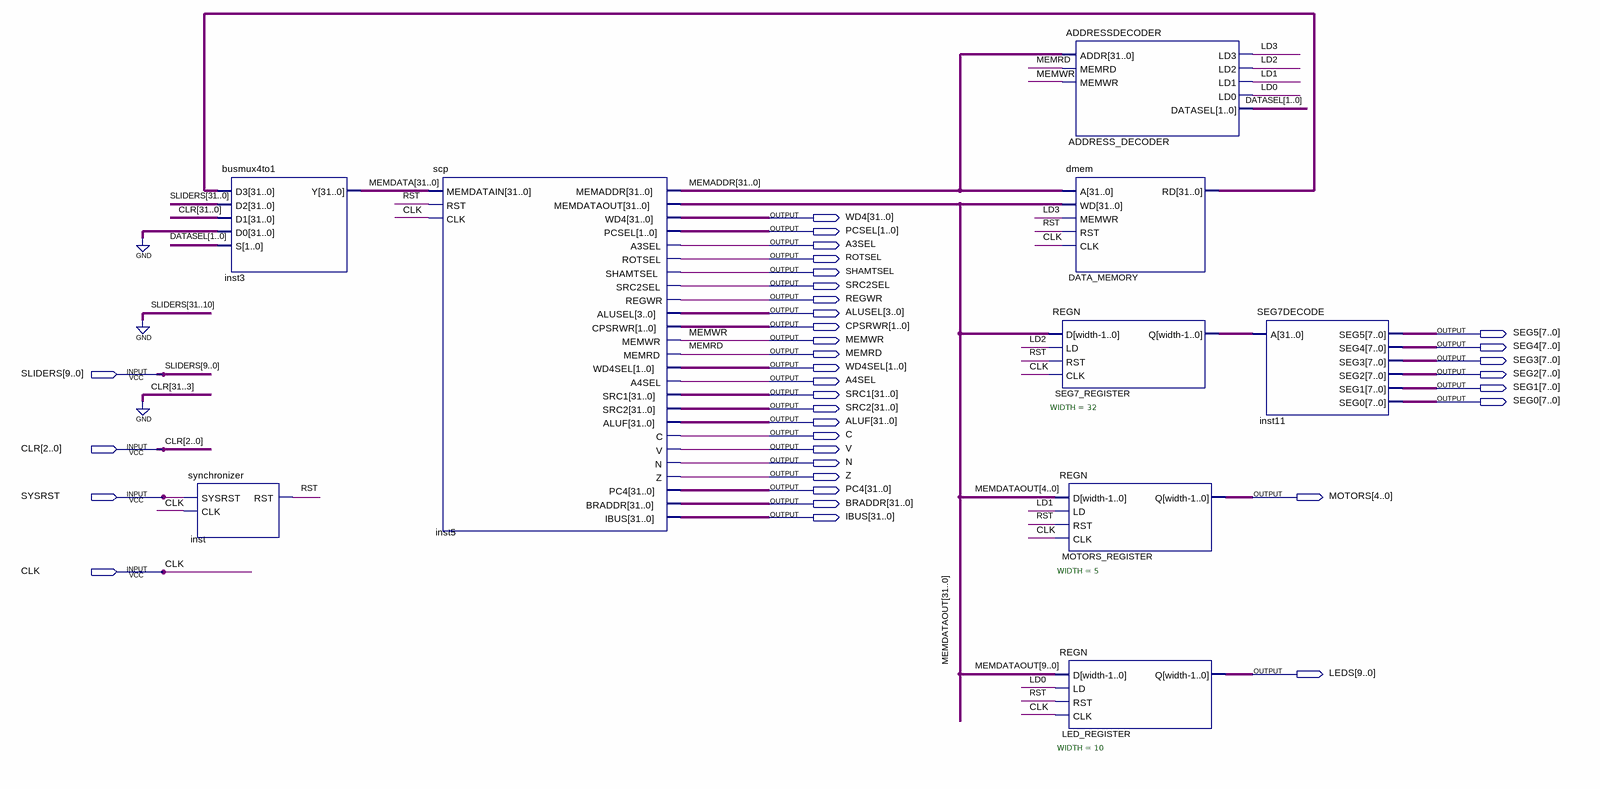
[diagram p0: schematic sheet]
// Quartus schematic scpmod.bdf as structural Verilog: 9 symbols, 35 pins
module scpmod (
  input  [9:0] SLIDERS,
  input  [2:0] CLR,
  input  SYSRST,
  input  CLK,
  output [31:0] WD4,
  output [1:0] PCSEL,
  output A3SEL,
  output ROTSEL,
  output SHAMTSEL,
  output SRC2SEL,
  output REGWR,
  output [3:0] ALUSEL,
  output [1:0] CPSRWR,
  output [7:0] SEG5,
  output MEMWR,
  output [7:0] SEG4,
  output MEMRD,
  output [7:0] SEG3,
  output [1:0] WD4SEL,
  output [7:0] SEG2,
  output A4SEL,
  output [7:0] SEG1,
  output [31:0] SRC1,
  output [7:0] SEG0,
  output [31:0] SRC2,
  output [31:0] ALUF,
  output C,
  output V,
  output N,
  output Z,
  output [31:0] PC4,
  output [4:0] MOTORS,
  output [31:0] BRADDR,
  output [31:0] IBUS,
  output [9:0] LEDS
);

  wire LD0, LD1, LD2, LD3, RST;
  wire [1:0] DATASEL;
  wire [31:0] DATA_MEMORY_rd, MEMADDR, MEMDATA, MEMDATAOUT, SEG7_REGISTER_q;

  busmux4to1 inst3 (
    .D3(DATA_MEMORY_rd), .D2({{22{1'b0}}, SLIDERS}), .D1({{29{1'b0}}, CLR}), .D0({32{1'b0}}), .S(DATASEL),
    .Y(MEMDATA));
  synchronizer inst (.SYSRST(SYSRST), .CLK(CLK), .RST(RST));
  scp inst5 (
    .MEMDATAIN(MEMDATA), .RST(RST), .CLK(CLK), .MEMADDR(MEMADDR), .MEMDATAOUT(MEMDATAOUT), .WD4(WD4),
    .PCSEL(PCSEL), .A3SEL(A3SEL), .ROTSEL(ROTSEL), .SHAMTSEL(SHAMTSEL), .SRC2SEL(SRC2SEL), .REGWR(REGWR),
    .ALUSEL(ALUSEL), .CPSRWR(CPSRWR), .MEMWR(MEMWR), .MEMRD(MEMRD), .WD4SEL(WD4SEL), .A4SEL(A4SEL),
    .SRC1(SRC1), .SRC2(SRC2), .ALUF(ALUF), .C(C), .V(V), .N(N), .Z(Z), .PC4(PC4), .BRADDR(BRADDR), .IBUS(IBUS));
  ADDRESSDECODER ADDRESS_DECODER (
    .ADDR(MEMADDR), .MEMRD(MEMRD), .MEMWR(MEMWR), .LD3(LD3), .LD2(LD2), .LD1(LD1), .LD0(LD0),
    .DATASEL(DATASEL));
  dmem DATA_MEMORY (.A(MEMADDR), .WD(MEMDATAOUT), .MEMWR(LD3), .RST(RST), .CLK(CLK), .RD(DATA_MEMORY_rd));
  REGN #(.WIDTH(32)) SEG7_REGISTER (.D(MEMDATAOUT), .LD(LD2), .RST(RST), .CLK(CLK), .Q(SEG7_REGISTER_q));
  REGN #(.WIDTH(5)) MOTORS_REGISTER (.D(MEMDATAOUT[4:0]), .LD(LD1), .RST(RST), .CLK(CLK), .Q(MOTORS));
  REGN #(.WIDTH(10)) LED_REGISTER (.D(MEMDATAOUT[9:0]), .LD(LD0), .RST(RST), .CLK(CLK), .Q(LEDS));
  SEG7DECODE inst11 (.A(SEG7_REGISTER_q), .SEG5(SEG5), .SEG4(SEG4), .SEG3(SEG3), .SEG2(SEG2), .SEG1(SEG1), .SEG0(SEG0));
endmodule
